# EAGLE design breakout (EAGLE 6.5.0)
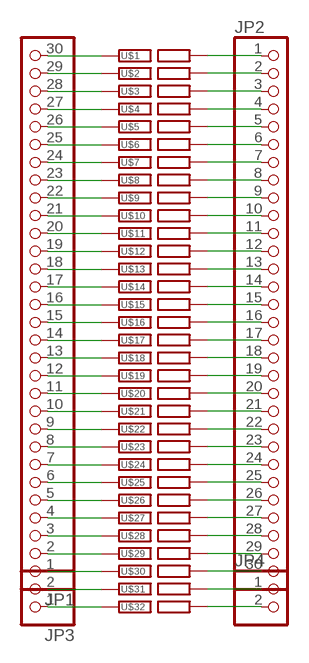
[diagram p0: schematic, sheet 1]

## Parts
JP1  PINHD-1X30  [1X30]
JP2  PINHD-1X30  [1X30]
JP3  PINHD-1X2  [1X02]
JP4  PINHD-1X2  [1X02]
U$1  RAILSEP  [RAIL]
U$2  RAILSEP  [RAIL]
U$3  RAILSEP  [RAIL]
U$4  RAILSEP  [RAIL]
U$5  RAILSEP  [RAIL]
U$6  RAILSEP  [RAIL]
U$7  RAILSEP  [RAIL]
U$8  RAILSEP  [RAIL]
U$9  RAILSEP  [RAIL]
U$10  RAILSEP  [RAIL]
U$11  RAILSEP  [RAIL]
U$12  RAILSEP  [RAIL]
U$13  RAILSEP  [RAIL]
U$14  RAILSEP  [RAIL]
U$15  RAILSEP  [RAIL]
U$16  RAILSEP  [RAIL]
U$17  RAILSEP  [RAIL]
U$18  RAILSEP  [RAIL]
U$19  RAILSEP  [RAIL]
U$20  RAILSEP  [RAIL]
U$21  RAILSEP  [RAIL]
U$22  RAILSEP  [RAIL]
U$23  RAILSEP  [RAIL]
U$24  RAILSEP  [RAIL]
U$25  RAILSEP  [RAIL]
U$26  RAILSEP  [RAIL]
U$27  RAILSEP  [RAIL]
U$28  RAILSEP  [RAIL]
U$29  RAILSEP  [RAIL]
U$30  RAILSEP  [RAIL]
U$31  RAILSEP  [RAIL]
U$32  RAILSEP  [RAIL]

## Nets
N$1: JP1.30 U$1.P$L(L)
N$2: JP1.29 U$2.P$L(L)
N$3: JP1.28 U$3.P$L(L)
N$4: JP1.27 U$4.P$L(L)
N$5: JP1.26 U$5.P$L(L)
N$6: JP1.25 U$6.P$L(L)
N$7: JP1.24 U$7.P$L(L)
N$8: JP1.23 U$8.P$L(L)
N$9: JP1.22 U$9.P$L(L)
N$10: JP1.21 U$10.P$L(L)
N$11: JP1.1 U$30.P$L(L)
N$12: JP1.20 U$11.P$L(L)
N$13: JP1.19 U$12.P$L(L)
N$14: JP1.18 U$13.P$L(L)
N$15: JP1.17 U$14.P$L(L)
N$16: JP1.16 U$15.P$L(L)
N$17: JP1.15 U$16.P$L(L)
N$18: JP1.14 U$17.P$L(L)
N$19: JP1.13 U$18.P$L(L)
N$20: JP1.12 U$19.P$L(L)
N$21: JP1.11 U$20.P$L(L)
N$22: JP1.10 U$21.P$L(L)
N$23: JP1.9 U$22.P$L(L)
N$24: JP1.8 U$23.P$L(L)
N$25: JP1.7 U$24.P$L(L)
N$26: JP1.6 U$25.P$L(L)
N$27: JP1.5 U$26.P$L(L)
N$28: JP1.4 U$27.P$L(L)
N$29: JP1.3 U$28.P$L(L)
N$30: JP1.2 U$29.P$L(L)
N$31: JP2.1 U$1.P$R(R)
N$32: JP2.2 U$2.P$R(R)
N$33: JP2.3 U$3.P$R(R)
N$34: JP2.4 U$4.P$R(R)
N$35: JP2.5 U$5.P$R(R)
N$36: JP2.6 U$6.P$R(R)
N$37: JP2.7 U$7.P$R(R)
N$38: JP2.8 U$8.P$R(R)
N$39: JP2.9 U$9.P$R(R)
N$40: JP2.10 U$10.P$R(R)
N$41: JP2.11 U$11.P$R(R)
N$42: JP2.12 U$12.P$R(R)
N$43: JP2.13 U$13.P$R(R)
N$44: JP2.14 U$14.P$R(R)
N$45: JP2.15 U$15.P$R(R)
N$46: JP2.16 U$16.P$R(R)
N$47: JP2.17 U$17.P$R(R)
N$48: JP2.18 U$18.P$R(R)
N$49: JP2.19 U$19.P$R(R)
N$50: JP2.20 U$20.P$R(R)
N$51: JP2.21 U$21.P$R(R)
N$52: JP2.22 U$22.P$R(R)
N$53: JP2.23 U$23.P$R(R)
N$54: JP2.24 U$24.P$R(R)
N$55: JP2.25 U$25.P$R(R)
N$56: JP2.26 U$26.P$R(R)
N$57: JP2.27 U$27.P$R(R)
N$58: JP2.28 U$28.P$R(R)
N$59: JP2.29 U$29.P$R(R)
N$60: JP2.30 U$30.P$R(R)
N$61: JP3.2 U$31.P$L(L)
N$62: JP3.1 U$32.P$L(L)
N$63: JP4.1 U$31.P$R(R)
N$64: JP4.2 U$32.P$R(R)

## Library data of the parts
JP1 JP2 = pinhead:PINHD-1X30: PIN HEADER
JP3 JP4 = pinhead:PINHD-1X2: PIN HEADER
U$1-U$32 = butter:RAILSEP

## Board
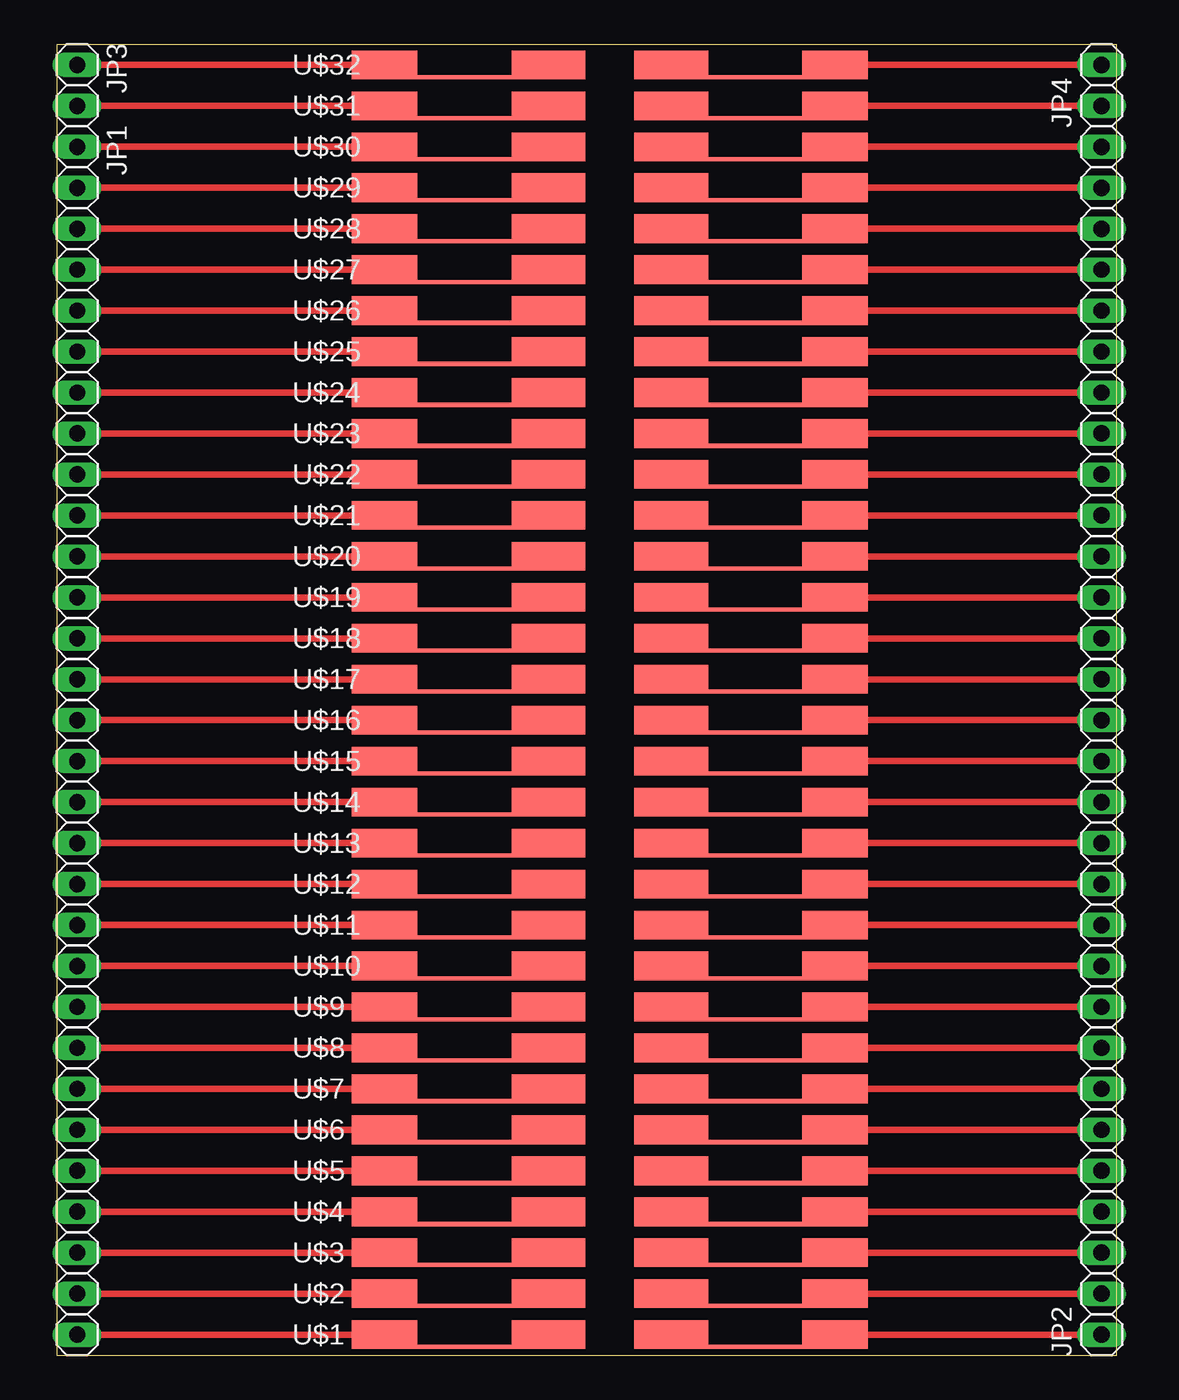
[diagram p1: board, top side]

Size 65.71 x 81.27 mm. Coordinates in mm from the lower left corner, seen from the top.
Outline: 0,0 65.71,0 65.71,81.27 0,81.27 0,0
Copper layers (1*16): Top 0.035mm / dielectric 1.5mm / Bottom 0.035mm
Design rules "default *": minimum track width 16mil, minimum drill 24mil, track to track 8mil, track to pad 8mil, pad to pad 8mil, via to via 8mil, smd to smd 8mil, copper to edge 40mil, drill to drill 8mil, minimum pad ring 10mil, minimum via ring 8mil, stop-mask expansion 4mil, vias tented up to drill 0mil, thermal gap 10mil

### Footprints (pad centres in the part's own frame; a part is rotated, then mirrored left to right if it is on the bottom)
1X30 = drill 1.016 long: 1 -36.83,0; 2 -34.29,0; 3 -31.75,0; 4 -29.21,0; 5 -26.67,0; 6 -24.13,0; 7 -21.59,0; 8 -19.05,0; 9 -16.51,0; 10 -13.97,0; 11 -11.43,0; 12 -8.89,0; 13 -6.35,0; 14 -3.81,0; 15 -1.27,0; 16 1.27,0; 17 3.81,0; 18 6.35,0; 19 8.89,0; 20 11.43,0; 21 13.97,0; 22 16.51,0; 23 19.05,0; 24 21.59,0; 25 24.13,0; 26 26.67,0; 27 29.21,0; 28 31.75,0; 29 34.29,0; 30 36.83,0
1X02 = drill 1.016 long: 1 -1.27,0; 2 1.27,0
RAIL = smd 14.478 x 0.254: P$1 -8.763,-0.762; P$2 8.763,-0.762 | smd 4.572 x 1.778: P$3 -3.81,0; P$4 3.81,0 | smd 4.064 x 1.778: P$L -13.97,0; P$R 13.97,0

### Placement (x,y rotation side)
JP1  1.27,38.1 270 top
JP2  64.77,38.1 90 top
JP3  1.27,78.74 270 top
JP4  64.77,78.74 90 top
U$1  34.29,1.27 0 top
U$2  34.29,3.81 0 top
U$3  34.29,6.35 0 top
U$4  34.29,8.89 0 top
U$5  34.29,11.43 0 top
U$6  34.29,13.97 0 top
U$7  34.29,16.51 0 top
U$8  34.29,19.05 0 top
U$9  34.29,21.59 0 top
U$10  34.29,24.13 0 top
U$11  34.29,26.67 0 top
U$12  34.29,29.21 0 top
U$13  34.29,31.75 0 top
U$14  34.29,34.29 0 top
U$15  34.29,36.83 0 top
U$16  34.29,39.37 0 top
U$17  34.29,41.91 0 top
U$18  34.29,44.45 0 top
U$19  34.29,46.99 0 top
U$20  34.29,49.53 0 top
U$21  34.29,52.07 0 top
U$22  34.29,54.61 0 top
U$23  34.29,57.15 0 top
U$24  34.29,59.69 0 top
U$25  34.29,62.23 0 top
U$26  34.29,64.77 0 top
U$27  34.29,67.31 0 top
U$28  34.29,69.85 0 top
U$29  34.29,72.39 0 top
U$30  34.29,74.93 0 top
U$31  34.29,77.47 0 top
U$32  34.29,80.01 0 top

### Tracks (layer width: path | path; a pad name or v marks a point on that pad's centre or on a via)
N$1
  Top 0.406: U$1.P$L JP1.30
N$2
  Top 0.406: U$2.P$L JP1.29
N$3
  Top 0.406: U$3.P$L JP1.28
N$4
  Top 0.406: U$4.P$L JP1.27
N$5
  Top 0.406: U$5.P$L JP1.26
N$6
  Top 0.406: U$6.P$L JP1.25
N$7
  Top 0.406: U$7.P$L JP1.24
N$8
  Top 0.406: U$8.P$L JP1.23
N$9
  Top 0.406: U$9.P$L JP1.22
N$10
  Top 0.406: U$10.P$L JP1.21
N$11
  Top 0.406: U$30.P$L JP1.1
N$12
  Top 0.406: U$11.P$L JP1.20
N$13
  Top 0.406: U$12.P$L JP1.19
N$14
  Top 0.406: U$13.P$L JP1.18
N$15
  Top 0.406: U$14.P$L JP1.17
N$16
  Top 0.406: U$15.P$L JP1.16
N$17
  Top 0.406: U$16.P$L JP1.15
N$18
  Top 0.406: U$17.P$L JP1.14
N$19
  Top 0.406: U$18.P$L JP1.13
N$20
  Top 0.406: U$19.P$L JP1.12
N$21
  Top 0.406: U$20.P$L JP1.11
N$22
  Top 0.406: U$21.P$L JP1.10
N$23
  Top 0.406: U$22.P$L JP1.9
N$24
  Top 0.406: U$23.P$L JP1.8
N$25
  Top 0.406: U$24.P$L JP1.7
N$26
  Top 0.406: U$25.P$L JP1.6
N$27
  Top 0.406: U$26.P$L JP1.5
N$28
  Top 0.406: U$27.P$L JP1.4
N$29
  Top 0.406: U$28.P$L JP1.3
N$30
  Top 0.406: U$29.P$L JP1.2
N$31
  Top 0.406: U$1.P$R JP2.1
N$32
  Top 0.406: U$2.P$R JP2.2
N$33
  Top 0.406: U$3.P$R JP2.3
N$34
  Top 0.406: U$4.P$R JP2.4
N$35
  Top 0.406: U$5.P$R JP2.5
N$36
  Top 0.406: U$6.P$R JP2.6
N$37
  Top 0.406: U$7.P$R JP2.7
N$38
  Top 0.406: U$8.P$R JP2.8
N$39
  Top 0.406: U$9.P$R JP2.9
N$40
  Top 0.406: U$10.P$R JP2.10
N$41
  Top 0.406: U$11.P$R JP2.11
N$42
  Top 0.406: U$12.P$R JP2.12
N$43
  Top 0.406: U$13.P$R JP2.13
N$44
  Top 0.406: U$14.P$R JP2.14
N$45
  Top 0.406: U$15.P$R JP2.15
N$46
  Top 0.406: U$16.P$R JP2.16
N$47
  Top 0.406: U$17.P$R JP2.17
N$48
  Top 0.406: U$18.P$R JP2.18
N$49
  Top 0.406: U$19.P$R JP2.19
N$50
  Top 0.406: U$20.P$R JP2.20
N$51
  Top 0.406: U$21.P$R JP2.21
N$52
  Top 0.406: U$22.P$R JP2.22
N$53
  Top 0.406: U$23.P$R JP2.23
N$54
  Top 0.406: U$24.P$R JP2.24
N$55
  Top 0.406: U$25.P$R JP2.25
N$56
  Top 0.406: U$26.P$R JP2.26
N$57
  Top 0.406: U$27.P$R JP2.27
N$58
  Top 0.406: U$28.P$R JP2.28
N$59
  Top 0.406: U$29.P$R JP2.29
N$60
  Top 0.406: U$30.P$R JP2.30
N$61
  Top 0.406: U$31.P$L JP3.2
N$62
  Top 0.406: U$32.P$L JP3.1
N$63
  Top 0.406: U$31.P$R JP4.1
N$64
  Top 0.406: U$32.P$R JP4.2